# EasyEDA Pro project RAM.eprj

# Schematic Schematic1
Board Name: Board1; Create Date: 2025-08-24; Page Name: P1; Project Name: RAM; Schematic Name: Schematic1; Update Date: 2025-08-25; Company: EasyEDA.com; Page Size: A4; Version: V1.0
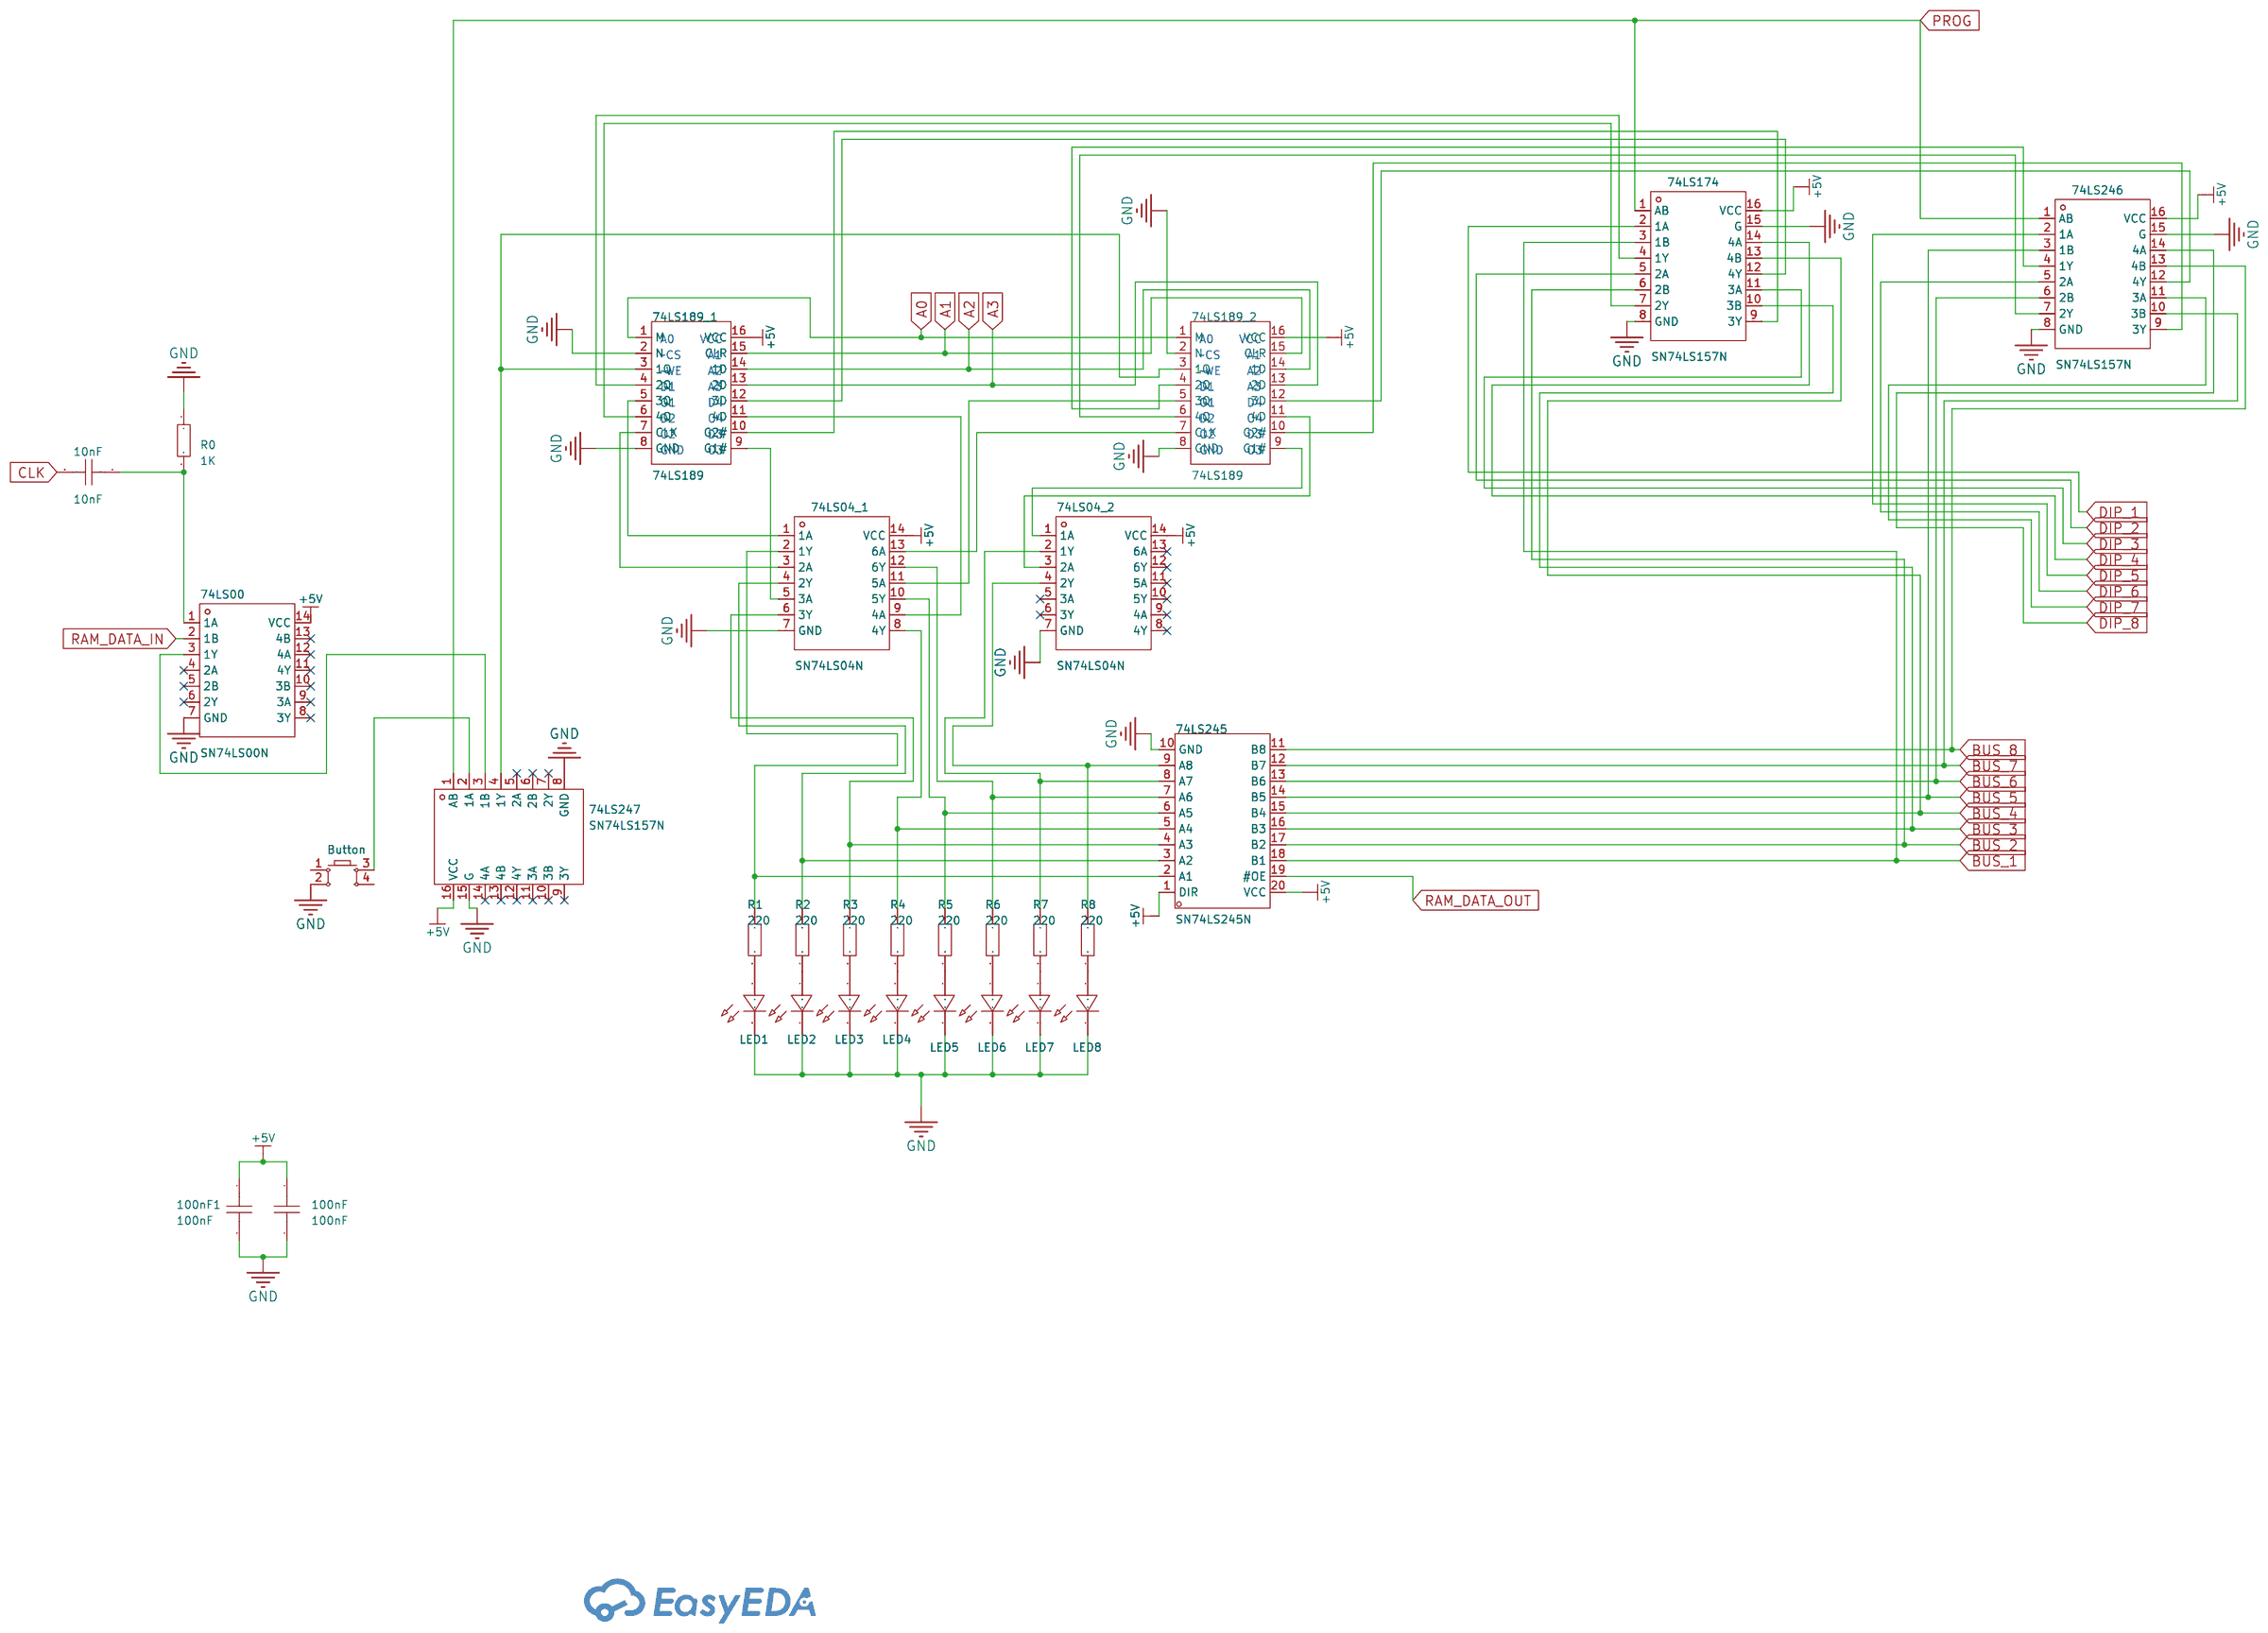
[diagram p0: schematic sheet]

## Parts
10nF  10nF  [CAP-TH_L8.5-W5.0-P5.00-D1.2]
74LS00  SN74LS00N  [PDIP-14_L19.7-W6.6-P2.54-LS8.3-BL]
74LS04_1  SN74LS04N  [PDIP-14_L19.7-W6.6-P2.54-LS8.3-BL]
74LS04_2  SN74LS04N  [PDIP-14_L19.7-W6.6-P2.54-LS8.3-BL]
74LS174  SN74LS157N  [DIP-16_16P-L20.2-W6.6-P2.54-LS7.6-BL]
74LS189_1  74LS189  [PDIP-16_L19.3-W6.4-P2.54-LS7.94-BL]
74LS189_2  74LS189  [PDIP-16_L19.3-W6.4-P2.54-LS7.94-BL]
74LS245  SN74LS245N  [DIP-20_L25.5-W10.0-P2.54-LS7.6-BL]
74LS246  SN74LS157N  [DIP-16_16P-L20.2-W6.6-P2.54-LS7.6-BL]
74LS247  SN74LS157N  [DIP-16_16P-L20.2-W6.6-P2.54-LS7.6-BL]
100nF  100nF  [CAP-TH_L8.5-W5.0-P5.00-D1.2]
100nF1  100nF  [CAP-TH_L8.5-W5.0-P5.00-D1.2]
Button  -  [SW-TH_4P-L6.0-W6.0-P4.50-LS6.5]
LED1  -  [LED-TH_BD5.8-P2.54-FD]
LED2  -  [LED-TH_BD5.8-P2.54-FD]
LED3  -  [LED-TH_BD5.8-P2.54-FD]
LED4  -  [LED-TH_BD5.8-P2.54-FD]
LED5  -  [LED-TH_BD5.8-P2.54-FD]
LED6  -  [LED-TH_BD5.8-P2.54-FD]
LED7  -  [LED-TH_BD5.8-P2.54-FD]
LED8  -  [LED-TH_BD5.8-P2.54-FD]
R0  1K  [R_AXIAL-0.4]
R1  220  [R_AXIAL-0.4]
R2  220  [R_AXIAL-0.4]
R3  220  [R_AXIAL-0.4]
R4  220  [R_AXIAL-0.4]
R5  220  [R_AXIAL-0.4]
R6  220  [R_AXIAL-0.4]
R7  220  [R_AXIAL-0.4]
R8  220  [R_AXIAL-0.4]

## Library data of the parts
10nF 100nF 100nF1 = CT4-0805B104K500F3: Capacitance:100nF Tolerance:±10% Tolerance:±10% Voltage Rated: Temperature Coefficient:; LCSC Part Name: 100nF ±10% 50V C3型（直脚）; Supplier Part: C84772; Manufacturer: FH(风华); Supplier Footprint: 插件,P=5.08mm; JLCPCB Part Class: Extended Part; Datasheet: https://atta.szlcsc.com/upload/public/pdf/source/20190402/C385200_059806A6312B28FF1421A2413EB641E1.pdf; Supplier: LCSC; Tolerance: ±10%
74LS00 = SN74LS00N: Supplier Part: C181629; Manufacturer: TI(德州仪器); Supplier Footprint: PDIP-14; JLCPCB Part Class: Extended Part; Datasheet: https://www.ti.com/cn/lit/gpn/sn74ls00; Supplier: LCSC; Logic Type: NAND Gate; Number of Channels: 4; Voltage - Supply: 4.75V~5.25V; Current - Output Low(IOL): 8mA; Current - Output High(IOH): 400uA; Input Logic Level - High: 2V; Input Logic Level - Low: 800mV; Series: 74LSSeries; Propagation Delay: 15ns@5V,15pF; Operating Temperature: 0℃~+70℃
74LS04_1 74LS04_2 = SN74LS04N: Voltage - Supply:4.75V~5.25V Voltage - Supply:4.75V~5.25V Number of Circuits:6 Number of Inputs:1 Current - Output Low(IOL):8mA Current - Output High(IOH):400uA Input Logic Level - High:2V Input Logic Level - High:2V Input Logic Level -Low:800mV Input Log; Supplier Part: C183657; Manufacturer: TI(德州仪器); Supplier Footprint: PDIP-14; JLCPCB Part Class: Extended Part; Datasheet: https://www.ti.com/cn/lit/gpn/sn74ls04; Supplier: LCSC; Voltage - Supply: 4.75V~5.25V; Number of Circuits: 6; Number of Inputs: 1; Current - Output Low(IOL): 8mA; Current - Output High(IOH): 400uA; Input Logic Level - High: 2V; Input Logic Level -Low: 800mV; Max Propagation Delay: 15ns@5V,15pF; Series: 74LSSeries; Operating Temperature: 0℃~+70℃
74LS174 74LS246 74LS247 = SN74LS157N: Type:Multiplexers Voltage Supply Source:Single supply Supply Voltage:4.75V~5.25V Supply Voltage:4.75V~5.25V Sink Current:8mA Source Current:400uA Operating temperature:0℃~+70℃ Operating temperature:0℃~+70℃; Supplier Part: C139317; Manufacturer: TI(德州仪器); Supplier Footprint: DIP-16; JLCPCB Part Class: Extended Part; Datasheet: https://www.ti.com/cn/lit/gpn/sn74ls157; Supplier: LCSC; Type: Multiplexers; Voltage Supply Source: Single supply; Supply Voltage: 4.75V~5.25V; Sink Current: 8mA; Source Current: 400uA; Operating temperature: 0℃~+70℃
74LS189_1 74LS189_2 = SN74LS173AN: Type:D-Type Trigger Type:Rising Edge Voltage - Supply:4.75V~5.25V Voltage - Supply:4.75V~5.25V Clock Frequency:50MHz Function:Reset Number of Elements:1 Number of Bits per Element:4 Output Type:- Propagation Delay:30ns@5V,45pF Series:74LS Series Current -; Supplier Part: C1550125; Manufacturer: TI(德州仪器); Supplier Footprint: PDIP-16; JLCPCB Part Class: Extended Part; Datasheet: https://www.ti.com/cn/lit/gpn/sn74ls173a; Supplier: LCSC; Type: D-Type; Trigger Type: Rising Edge; Voltage - Supply: 4.75V~5.25V; Clock Frequency: 50MHz; Function: Reset; Number of Elements: 1; Number of Bits per Element: 4; Propagation Delay: 30ns@5V,45pF; Series: 74LS Series; Current - Output Low(IOL): 24mA; Current - Output High(IOH): 2.6mA; Quiescent Current: 24mA; Operating Temperature: 0℃~+70℃
74LS245 = SN74LS245N: output type:Tri-State Voltage - Supply:4.75V~5.25V Voltage - Supply:4.75V~5.25V Number of Elements:1 Number of Bits per Element:8 Current - Output Low(IOL):24mA Current - Output High(IOH):15mA Logic Family:74LS Operating Temperature:0℃~+70℃ Operating Temp; Supplier Part: C352966; Manufacturer: TI(德州仪器); Supplier Footprint: DIP-20; JLCPCB Part Class: Extended Part; Datasheet: https://www.ti.com/cn/lit/gpn/sn74ls245; Supplier: LCSC; output type: Tri-State; Voltage - Supply: 4.75V~5.25V; Number of Elements: 1; Number of Bits per Element: 8; Current - Output Low(IOL): 24mA; Current - Output High(IOH): 15mA; Logic Family: 74LS; Operating Temperature: 0℃~+70℃
Button = Key_TH_6x6x6: Supplier Footprint: Through
LED1-LED8 = LED_TH-R_5mm: Supplier Footprint: Through
R0-R8 = Res_AXIAL-1/4W: Supplier Footprint: Through

## Nets
+5V: 74LS00.14(VCC) 74LS04_1.14(VCC) 74LS04_2.14(VCC) 74LS174.16(VCC) 74LS189_1.16(VCC) 74LS189_2.16(VCC) 74LS245.1(DIR) 74LS245.20(VCC) 74LS246.16(VCC) 74LS247.16(VCC) 100nF.1 100nF1.1
GND: 74LS00.7(GND) 74LS04_1.7(GND) 74LS04_2.7(GND) 74LS174.8(GND) 74LS174.15(G) 74LS189_1.2(N) 74LS189_1.8(GND) 74LS189_2.2(N) 74LS189_2.8(GND) 74LS245.10(GND) 74LS246.8(GND) 74LS246.15(G) 74LS247.8(GND) 74LS247.15(G) 100nF.2 100nF1.2 Button.2 LED1.2(A) LED2.2(A) LED3.2(A) LED4.2(A) LED5.2(A) LED6.2(A) LED7.2(A) LED8.2(A) R0.1
A0: 74LS189_1.1(M) 74LS189_2.1(M)
A1: 74LS189_1.15(CLR) 74LS189_2.15(CLR)
A2: 74LS189_1.14(1D) 74LS189_2.14(1D)
A3: 74LS189_1.13(2D) 74LS189_2.13(2D)
BUS_1: 74LS174.3(1B) 74LS245.18(B1)
BUS_2: 74LS174.6(2B) 74LS245.17(B2)
BUS_3: 74LS174.10(3B) 74LS245.16(B3)
BUS_4: 74LS174.13(4B) 74LS245.15(B4)
BUS_5: 74LS245.14(B5) 74LS246.3(1B)
BUS_6: 74LS245.13(B6) 74LS246.6(2B)
BUS_7: 74LS245.12(B7) 74LS246.10(3B)
BUS_8: 74LS245.11(B8) 74LS246.13(4B)
CLK: 10nF.2
DIP_1: 74LS174.2(1A)
DIP_2: 74LS174.5(2A)
DIP_3: 74LS174.11(3A)
DIP_4: 74LS174.14(4A)
DIP_5: 74LS246.2(1A)
DIP_6: 74LS246.5(2A)
DIP_7: 74LS246.11(3A)
DIP_8: 74LS246.14(4A)
PROG: 74LS174.1(AB) 74LS246.1(AB) 74LS247.1(AB)
RAM_DATA_IN: 74LS00.2(1B)
RAM_DATA_OUT: 74LS245.19(#OE)
Net-(10nF-1): 10nF.1 74LS00.1(1A) R0.2
Net-(74LS00-3): 74LS00.3(1Y) 74LS247.3(1B)
Net-(74LS04_1-1): 74LS04_1.1(1A) 74LS189_1.5(3Q)
Net-(74LS04_1-2): 74LS04_1.2(1Y) 74LS245.2(A1) R1.1
Net-(74LS04_1-3): 74LS04_1.3(2A) 74LS189_1.7(CLK)
Net-(74LS04_1-4): 74LS04_1.4(2Y) 74LS245.3(A2) R2.1
Net-(74LS04_1-5): 74LS04_1.5(3A) 74LS189_1.9(G1#)
Net-(74LS04_1-6): 74LS04_1.6(3Y) 74LS245.4(A3) R3.1
Net-(74LS04_1-8): 74LS04_1.8(4Y) 74LS245.5(A4) R4.1
Net-(74LS04_1-9): 74LS04_1.9(4A) 74LS189_1.11(4D)
Net-(74LS04_1-10): 74LS04_1.10(5Y) 74LS245.6(A5) R5.1
Net-(74LS04_1-11): 74LS04_1.11(5A) 74LS189_2.5(3Q)
Net-(74LS04_1-12): 74LS04_1.12(6Y) 74LS245.7(A6) R6.1
Net-(74LS04_1-13): 74LS04_1.13(6A) 74LS189_2.7(CLK)
Net-(74LS04_2-1): 74LS04_2.1(1A) 74LS189_2.9(G1#)
Net-(74LS04_2-2): 74LS04_2.2(1Y) 74LS245.8(A7) R7.1
Net-(74LS04_2-3): 74LS04_2.3(2A) 74LS189_2.11(4D)
Net-(74LS04_2-4): 74LS04_2.4(2Y) 74LS245.9(A8) R8.1
Net-(74LS174-4): 74LS174.4(1Y) 74LS189_1.4(2Q)
Net-(74LS174-7): 74LS174.7(2Y) 74LS189_1.6(4Q)
Net-(74LS174-9): 74LS174.9(3Y) 74LS189_1.10(G2#)
Net-(74LS174-12): 74LS174.12(4Y) 74LS189_1.12(3D)
Net-(74LS189_1-3): 74LS189_1.3(1Q) 74LS189_2.3(1Q) 74LS247.4(1Y)
Net-(74LS189_2-4): 74LS189_2.4(2Q) 74LS246.4(1Y)
Net-(74LS189_2-6): 74LS189_2.6(4Q) 74LS246.7(2Y)
Net-(74LS189_2-10): 74LS189_2.10(G2#) 74LS246.9(3Y)
Net-(74LS189_2-12): 74LS189_2.12(3D) 74LS246.12(4Y)
Net-(74LS247-2): 74LS247.2(1A) Button.3
Net-(LED1-1): LED1.1(C) R1.2
Net-(LED2-1): LED2.1(C) R2.2
Net-(LED3-1): LED3.1(C) R3.2
Net-(LED4-1): LED4.1(C) R4.2
Net-(LED5-1): LED5.1(C) R5.2
Net-(LED6-1): LED6.1(C) R6.2
Net-(LED7-1): LED7.1(C) R7.2
Net-(LED8-1): LED8.1(C) R8.2

Not connected (* = marked no-connect by the designer): 74LS00 4(2A)* 5(2B)* 6(2Y)* 8(3Y)* 9(3A)* 10(3B)* 11(4Y)* 12(4A)* 13(4B)*; 74LS04_2 5(3A)* 6(3Y)* 8(4Y)* 9(4A)* 10(5Y)* 11(5A)* 12(6Y)* 13(6A)*; 74LS247 5(2A)* 6(2B)* 7(2Y)* 9(3Y)* 10(3B)* 11(3A)* 12(4Y)* 13(4B)* 14(4A)*; Button 1 4

## Notes on the sheet
- A0
- VCC
- A0
- VCC
- ~CS
- ~WE
- A1
- A2
- ~CS
- ~WE
- A1
- A2
- D1
- A3
- D1
- A3
- O1
- D4
- O1
- D4
- D2
- O4
- D2
- O4
- O2
- D3
- O2
- D3
- GND
- O3
- GND
- O3
